# Altium schematic sheet STMod+.SchDoc: STMod+
size A4; CompanyName: STMicroelectronics; Organization: Microcontrollers Division; DocumentNumber: 17; SheetNumber: 14; SheetTotal: 19
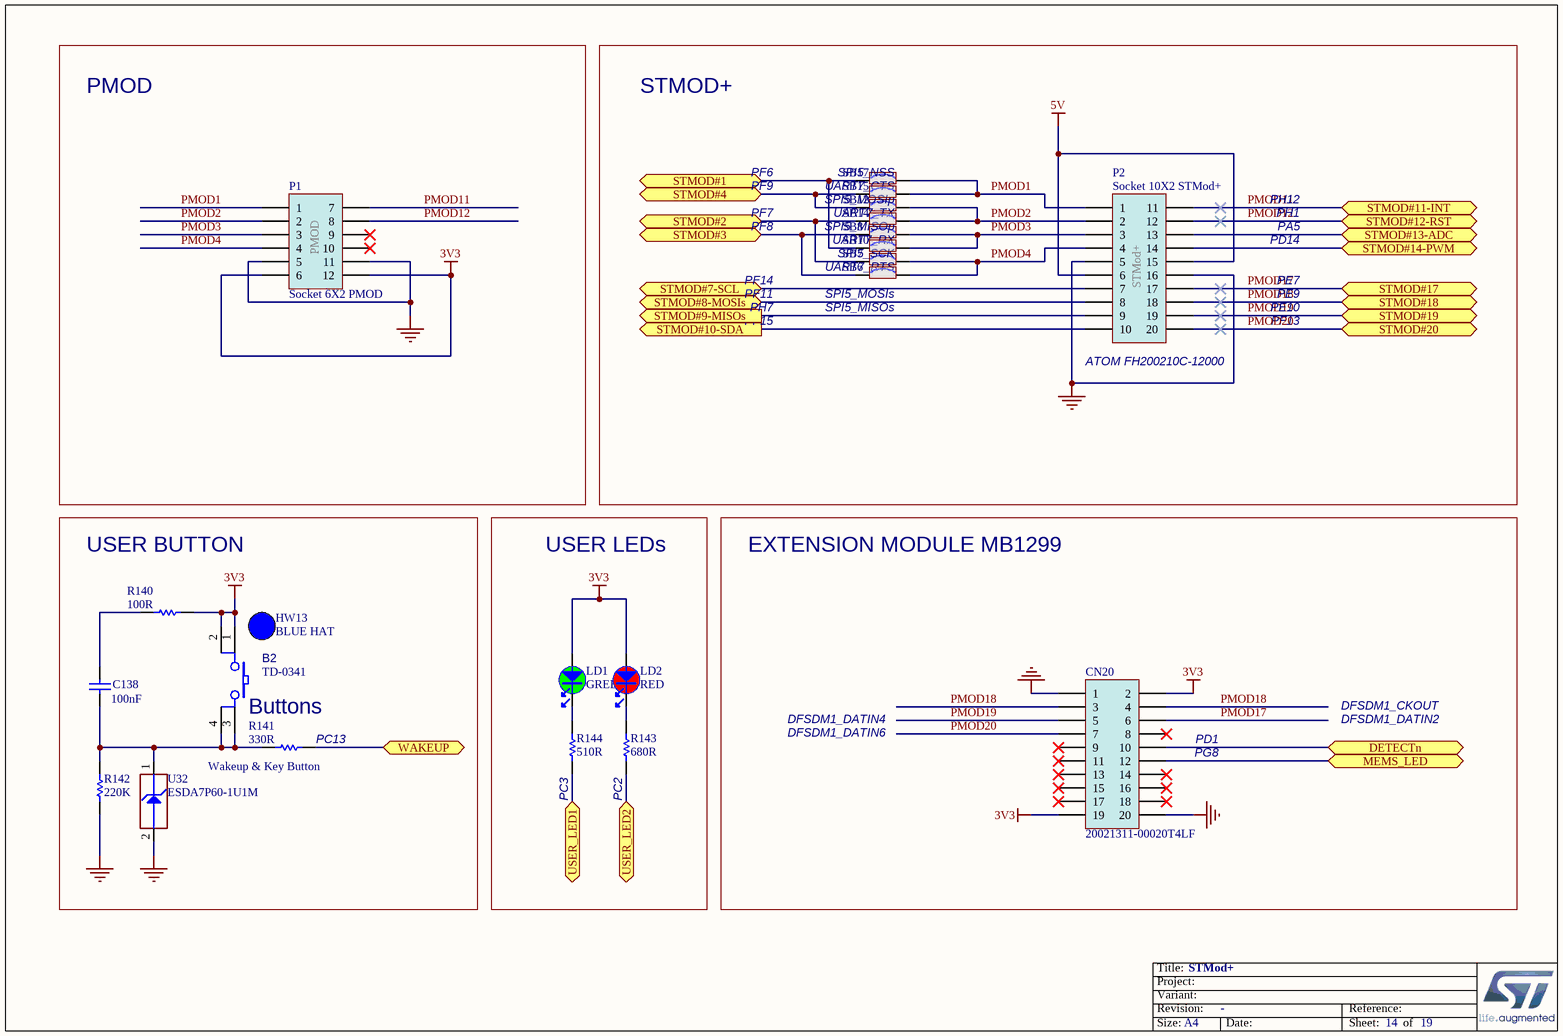
[diagram p0: STMod+.SchDoc]

## Parts
B2  Manufacturer_Part_Number: TD-0341  [SWI_WEALTHMETAL_TD-0341_4P_BLUE]  (hidden comment: SW-PUSH-CMS)
C138  value 100nF  [C0402]  (hidden comment: Capacitor)
CN20  value 20021311-00020T4LF  [CON_FCI_20021311-XXX20XXLF]  (hidden comment: Socket 10x2)
HW13  value BLUE HAT  (hidden comment: BUTTON_HAT_BLUE)  (mechanical)
LD1  value GREEN  [LED_0603_GREEN]  (hidden comment: LED_green)
LD2  value RED  [LED_0603_RED]  (hidden comment: LED_red)
P1  Socket 6X2 PMOD  [CON_SAMTEC_SSW-106-02-F-D-RA__PMOD]
P2  Socket 10X2 STMod+  [CON_SAMTEC_SQT-110-01-F-D-RA__STMOD+]
R140  value 100R  [R0402]  (hidden comment: Resistor)
R141  value 330R  [R0402]  (hidden comment: Resistor)
R142  value 220K  [R0402]  (hidden comment: Resistor)
R143  value 680R  [R0603]  (hidden comment: Resistor)
R144  value 510R  [R0603]  (hidden comment: Resistor)
SB6  SB_ON  [SOLDER-BRIDGE_R0603-0R]  (value not drawn)
SB7  SB_ON  [SOLDER-BRIDGE_R0603-0R]  (value not drawn)
SB8  SB_ON  [SOLDER-BRIDGE_R0603-0R]  (value not drawn)
SB10  SB_ON  [SOLDER-BRIDGE_R0603-0R]  (value not drawn)
SB12  SB_ON  [SOLDER-BRIDGE_R0603-0R]  (value not drawn)
SB14  SB_ON  [SOLDER-BRIDGE_R0603-0R]  (value not drawn)
SB15  SB_ON  [SOLDER-BRIDGE_R0603-0R]  (value not drawn)
SB17  SB_ON  [SOLDER-BRIDGE_R0603-0R]  (value not drawn)
U32  value ESDA7P60-1U1M  [ESD_QFN2_1P6X1_P125]  (hidden comment: ESD-TRANSIL)

## Blocks framed on the sheet
PMOD: P1
STMOD+: P2 SB6-SB8 SB10 SB12 SB14 SB15 SB17
USER LEDs: LD1 LD2 R143 R144
EXTENSION MODULE MB1299: CN20

## Ports
DETECTn, MEMS_LED, STMOD#1, STMOD#2, STMOD#3, STMOD#4, STMOD#7-SCL, STMOD#8-MOSIs, STMOD#9-MISOs (out), STMOD#10-SDA (out), STMOD#11-INT, STMOD#12-RST, STMOD#13-ADC, STMOD#14-PWM, STMOD#17, STMOD#18, STMOD#19, STMOD#20, USER_LED1, USER_LED2, WAKEUP

## Nets
3V3: B2.1 B2.2 CN20.2 CN20.19 LD1.1 LD2.1 P1.6 P1.12 R140.2
5V: P2.6 P2.15
GND: CN20.1 CN20.20 P1.5 P1.11 P2.5 P2.16 R142.1 U32.2(GND)
DETECTn: CN20.10 ; port DETECTn
MEMS_LED: CN20.12 ; port MEMS_LED
PMOD1: P1.1 P2.1 SB15.2 SB17.2
PMOD2: P1.2 P2.2 SB12.2 SB14.2
PMOD3: P1.3 P2.3 SB8.2 SB10.2
PMOD4: P1.4 P2.4 SB6.2 SB7.2
PMOD11: P1.7 P2.11 ; port STMOD#11-INT
PMOD12: P1.8 P2.12 ; port STMOD#12-RST
PMOD17: CN20.6 P2.17 ; port STMOD#17
PMOD18: CN20.3 CN20.4 P2.18 ; port STMOD#18
PMOD19: CN20.5 P2.19 ; port STMOD#19
PMOD20: CN20.7 P2.20 ; port STMOD#20
STMOD#1: SB10.1 SB17.1 ; port STMOD#1
STMOD#2: SB7.1 SB14.1 ; port STMOD#2
STMOD#3: SB6.1 SB8.1 ; port STMOD#3
STMOD#4: SB12.1 SB15.1 ; port STMOD#4
STMOD#7-SCL: P2.7 ; port STMOD#7-SCL
STMOD#8-MOSIs: P2.8 ; port STMOD#8-MOSIs
STMOD#9-MISOs: P2.9 ; port STMOD#9-MISOs
STMOD#10-SDA: P2.10 ; port STMOD#10-SDA
STMOD#13-ADC: P2.13 ; port STMOD#13-ADC
STMOD#14-PWM: P2.14 ; port STMOD#14-PWM
USER_LED1: R144.1 ; port USER_LED1
USER_LED2: R143.1 ; port USER_LED2
WAKEUP: R141.2 ; port WAKEUP
NetB2_3: B2.3 B2.4 C138.2 R141.1 R142.2 U32.1(IO1)
NetC138_1: C138.1 R140.1
NetLD1_2: LD1.2 R144.2
NetLD2_2: LD2.2 R143.2

Not connected (* = marked no-connect by the designer): CN20 8* 9* 11* 13* 14* 15* 16* 17* 18*; P1 9* 10*

## Notes on the sheet
- PF6
- (near SB17) SPI5_NSS
- PF9
- PF7
- PF8
- UART7_CTS
- SPI5_MOSIp
- UART7_TX
- SPI5_MISOp
- UART7_RX
- PH1
- PA5
- PH12
- PD14
- PF14
- PF11
- PH7
- SPI5_SCK
- UART7_RTS
- (near SB6) SPI5_MOSIs
- SPI5_MISOs
- PE7
- PE9
- PE10
- PF15
- (near P2) ATOM FH200210C-12000
- PF13
- USER BUTTON
- (near B2) Buttons
- DFSDM1_CKOUT
- (near R141) Wakeup & Key Button
- (near R141) PC13
- DFSDM1_DATIN4
- DFSDM1_DATIN6
- PD1
- PG8
- DFSDM1_DATIN2
- (near R144) PC3
- (near R143) PC2
- Title:
- Project:
- Size:
- Revision:
- Variant:
- A4
- -
- Date:
- Reference:
- Sheet:
- of
- (in symbol MCD-00308) PMOD
- (in symbol MCD-00309) STMod+

## Library data of the parts
B2 = MCD-00002: Non-Open Push-Button 0.1A 24V; Part_Type: Misc; Manufacturer: WEALTHMETAL; Value: SWITCH; Provided_By: SUBCO; Internal_Part_Number: MCD-00002; Status: Released; ComponentLink1Description: Datasheet; ComponentLink1URL: http://tunmcdsvn.tun.st.com/Component_Datasheet_Library/Trunk/Misc/Wealthmetal_Tact-Switch_TD0341
C138 = MCD-00102: Capacitor, MLCC, 100nF, 16V, X7R, 10%, 0402, T=0,5mm; Manufacturer_Part_Number: CC0402KRX7R7BB104; Manufacturer: YAGEO; Alternate_Manufacturer_Part_Number: GCM155R71C104KA55D; Alternate_Manufacturer: MURATA; Provided_By: SUBCO; Internal_Part_Number: MCD-00102; Status: Released; Part_Type: Capacitor; Package: C0402; ComponentLink1Description: Datasheet; ComponentLink1URL: http://tunmcdsvn.tun.st.com/Component_Datasheet_Library/Trunk/Capacitors/Yageo_Multilayer_Capacitor_X7R_series_100pF_to_22uF
CN20 = MCD-00147: Socket for MB1299, 10x2, 1.27mm, VR, TH, Height 4.30mm/2.40mm; Part_Type: Connector; Manufacturer: FCI; Alternate_Manufacturer_Part_Number: 234220S1410; Alternate_Manufacturer: JIUBABA; Provided_By: SUBCO; Internal_Part_Number: MCD-00147; Status: Released; Manufacturer_Part_Number: 20021311-00020T4LF; ComponentLink1Description: Datasheet; ComponentLink1URL: http://tunmcdsvn.tun.st.com/Component_Datasheet_Library/Trunk/Connectors/FCI_Minitek127_Catalog
HW13 = MCD-00634: Blue Hat for switch TD0341X-G01-BLU; Part_Type: Mechanical; Manufacturer_Part_Number: 988.16.09.3.00002_SH-517; Manufacturer: JIUBABA; Provided_By: SUBCO; Internal_Part_Number: MCD-00634; Status: Released; ComponentLink1Description: Datasheet; ComponentLink1URL: http://tunmcdsvn.tun.st.com/Component_Datasheet_Library/Trunk/Mechanical/Jiubaba_HAT_SH-517
LD1 = MCD-00050: LED, Green, 0603; Part_Type: Display; Manufacturer_Part_Number: 19-213SYGC/S530-E2/TR8; Manufacturer: EVERLIGHT; Provided_By: SUBCO; Internal_Part_Number: MCD-00050; Status: Released; ComponentLink1Description: Datasheet; ComponentLink1URL: http://tunmcdsvn.tun.st.com/Component_Datasheet_Library/Trunk/Display/Everlight_SMD-LED-GREEN_19-213SYGC-S530-XX-TR8-v3.doc; Package: LED 0603
LD2 = MCD-00049: LED, Red, 0603; Manufacturer_Part_Number: 19-213-R6C-AP1Q2B/3T; Manufacturer: EVERLIGHT; Part_Type: Display; Provided_By: SUBCO; Internal_Part_Number: MCD-00049; ComponentLink1Description: Datasheet; Status: Released; ComponentLink1URL: http://tunmcdsvn.tun.st.com/Component_Datasheet_Library/Trunk/Display/Everlight_SMD-LED-RED_19-213-R6C-AP1Q2B-3T-V3.doc; Package: LED 0603
P1 = MCD-00308: Socket, 6x2, 2.54mm, TH, RA, Height 8.51mm/7.62mm; Part_Type: Connector; Manufacturer_Part_Number: SSW-106-02-F-D-RA; Manufacturer: SAMTEC; Provided_By: SUBCO; Internal_Part_Number: MCD-00308; Value: Socket 6X2 PMOD; Status: Released; ComponentLink1Description: Datasheet; ComponentLink1URL: http://tunmcdsvn.tun.st.com/Component_Datasheet_Library/Trunk/Connectors/Samtec_SSW_smt_series
P2 = MCD-00309: Socket 10x2, 2.00mm, RA, TH, Height 6.35mm/2.29mm; Part_Type: Connector; Manufacturer_Part_Number: SQT-110-01-F-D-RA; Manufacturer: SAMTEC; Alternate_Manufacturer_Part_Number: FH200020C-12300; Alternate_Manufacturer: JIUBABA; Provided_By: SUBCO; Internal_Part_Number: MCD-00309; Value: Socket 10X2 STMod+; Status: Released; ComponentLink1Description: Datasheet; ComponentLink1URL: http://tunmcdsvn.tun.st.com/Component_Datasheet_Library/Trunk/Connectors/Samtec_SQT_series
R140 = MCD-00119: Resistor,100R,0402,1%,1/16W; Manufacturer_Part_Number: RC0402FR-07100RL; Manufacturer: YAGEO; Provided_By: SUBCO; Internal_Part_Number: MCD-00119; Status: Released; Part_Type: Resistor; Package: R0402; ComponentLink1Description: Datasheet; ComponentLink1URL: http://tunmcdsvn.tun.st.com/Component_Datasheet_Library/Trunk/Resistors/Yageo_Resistor_RC0402-series
R141 = MCD-00062: Resistor,330R,0402,1%,1/16W; Manufacturer_Part_Number: RC0402FR-07330RL; Manufacturer: YAGEO; Provided_By: SUBCO; Internal_Part_Number: MCD-00062; Status: Released; Part_Type: Resistor; Package: R0402; ComponentLink1Description: Datasheet; ComponentLink1URL: http://tunmcdsvn.tun.st.com/Component_Datasheet_Library/Trunk/Resistors/Yageo_Resistor_RC0402-series
R142 = MCD-00164: Resistor,220K,0402,1%,1/16W; Manufacturer_Part_Number: RC0402FR-07220KL; Manufacturer: YAGEO; Provided_By: SUBCO; Internal_Part_Number: MCD-00164; Status: Checked; Part_Type: Resistor; Package: R0402; ComponentLink1Description: Datasheet; ComponentLink1URL: http://tunmcdsvn.tun.st.com/Component_Datasheet_Library/Trunk/Resistors/Yageo_Resistor_RC0402-series
R143 = MCD-00508: Resistor,680R,0603,1%,1/10W; Manufacturer_Part_Number: RC0603FR-07680RL; Manufacturer: YAGEO; ECCN_US: EAR99; ECCN_EU: NEC; Provided_By: SUBCO; Internal_Part_Number: MCD-00508; Status: Released; Part_Type: Resistor; Package: R0603; ComponentLink1Description: Datasheet; ComponentLink1URL: http://tunmcdsvn.tun.st.com/Component_Datasheet_Library/Trunk/Resistors/Yageo_Resistor_RC0603-series
R144 = MCD-00225: Resistor,510R,0603,1%,1/10W; Manufacturer_Part_Number: RC0603FR-07510RL; Manufacturer: YAGEO; Provided_By: SUBCO; Internal_Part_Number: MCD-00225; ComponentLink1Description: Datasheet; Status: Released; Part_Type: Resistor; Package: R0603; ComponentLink1URL: http://tunmcdsvn.tun.st.com/Component_Datasheet_Library/Trunk/Resistors/Yageo_Resistor_RC0603-series
SB6-SB8 SB10 SB12 SB14 SB15 SB17 = MCD-00071: Solder Bridge ON; Part_Type: Mechanical; Manufacturer_Part_Number: RC0603JR-070RL; Manufacturer: YAGEO; Provided_By: SUBCO; Internal_Part_Number: MCD-00071; Status: Released; Package: SB0603; ComponentLink1Description: Datasheet; ComponentLink1URL: http://tunmcdsvn.tun.st.com/Component_Datasheet_Library/Trunk/Resistors/Yageo_Resistor_RC0603-series
U32 = MCD-00251: High power transient voltage suppressor, 7V breakdown; Part_Type: Diode; Manufacturer: STMICROELECTRONICS; BMS_Part_Number: 9179042; Provided_By: SUBCO with ST control; Internal_Part_Number: MCD-00251; Status: Released; Manufacturer_Part_Number: ESDA7P60-1U1M; ComponentLink1Description: Datasheet; ComponentLink1URL: http://tunmcdsvn.tun.st.com/Component_Datasheet_Library/Trunk/Diodes/STM_ESD_ESDA7P60-1U1M